# EAGLE board STM32-H407_Rev_B (EAGLE 4.16), part 1 of 2
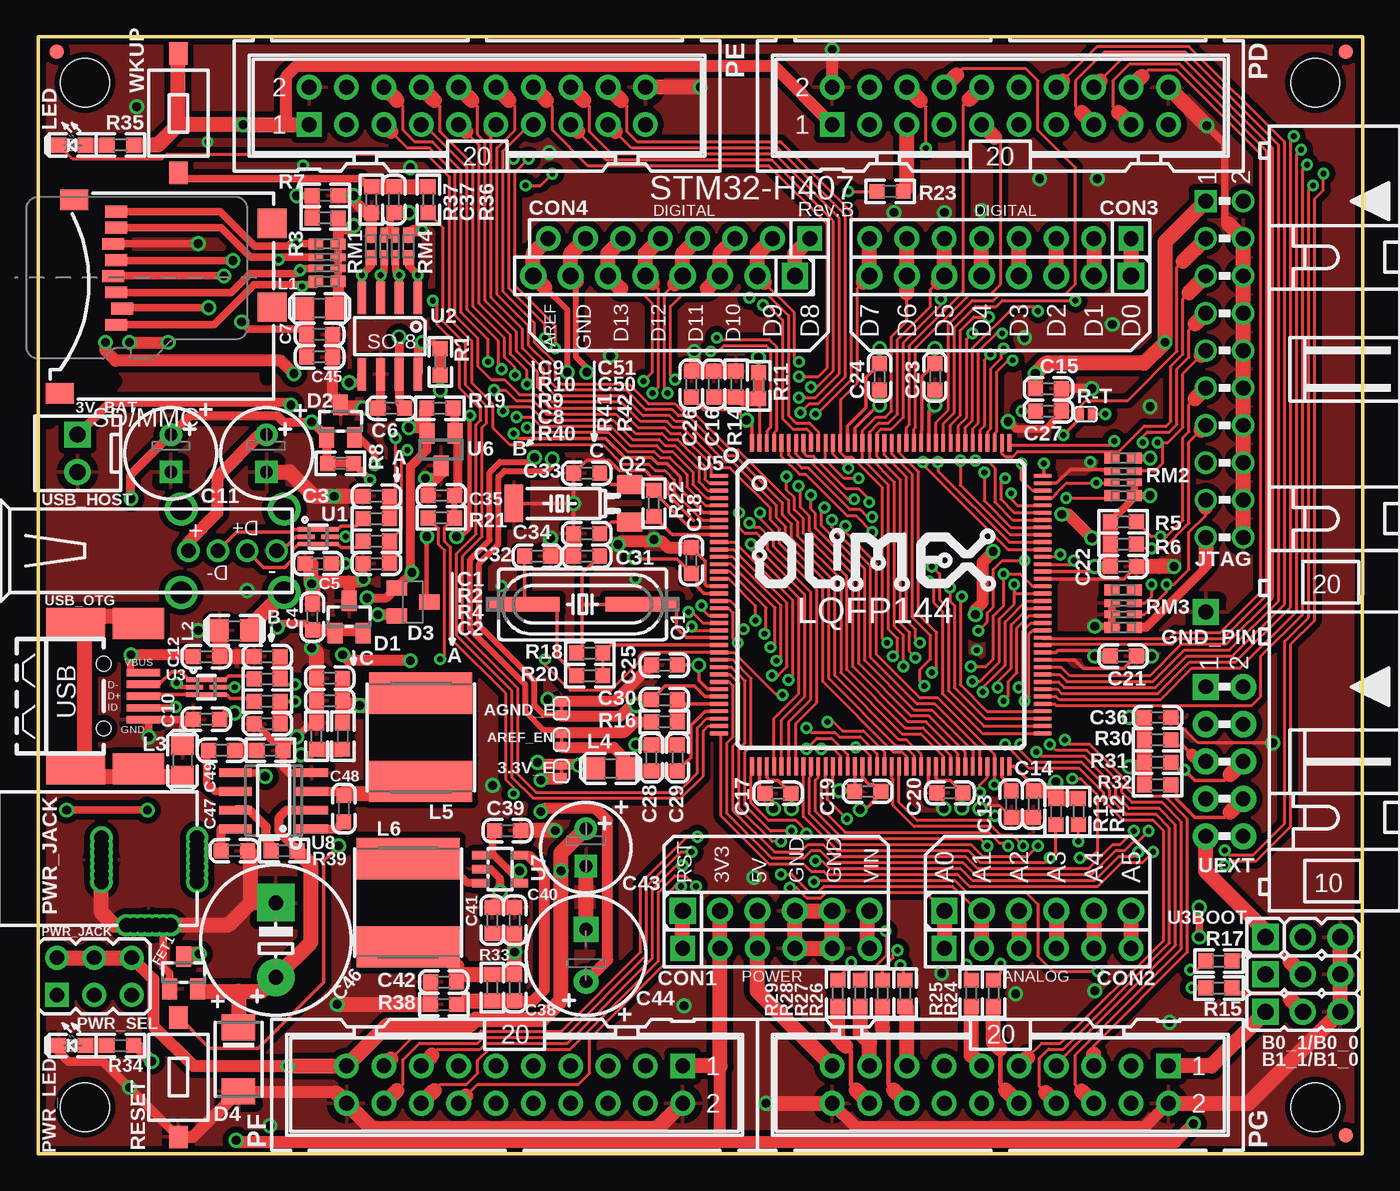
[diagram p1: board, top side]
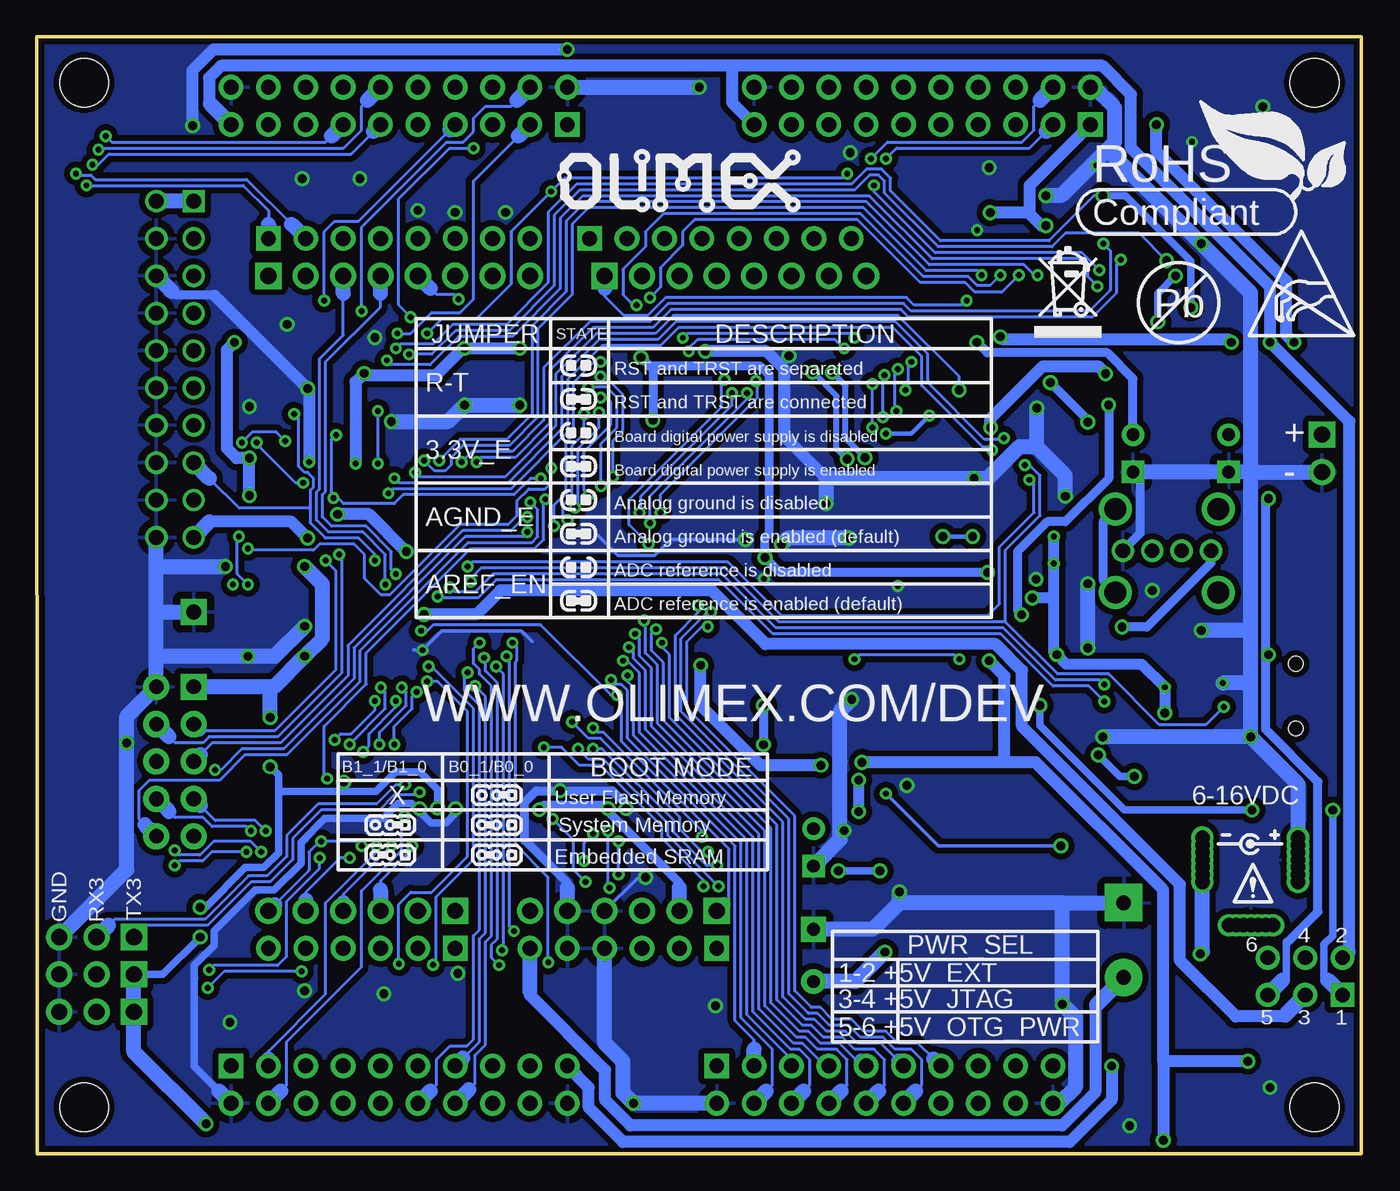
[diagram p2: board, bottom side, seen from below]

Size 90.04 x 75.95 mm. Coordinates in mm from the lower left corner, seen from the top.
Outline: 0,0 90,0 90.04,75.95 0,75.95 0,0
Copper layers (1+16): Top 0.035mm / dielectric 1.5mm / Bottom 0.035mm
Design rules "default": minimum track width 8mil, minimum drill 0.4mm, track to track 7.5mil, track to pad 7.5mil, pad to pad 7.5mil, via to via 7.5mil, smd to smd 1mil, copper to edge 10mil, drill to drill 8mil, minimum pad ring 10mil, minimum via ring 8mil, stop-mask expansion 4mil, vias tented up to drill 25mil, thermal gap 20mil
Net classes: 1 PWR: width 0.203 mm, drill 0.076 mm, clearance 0.4 mm; 2 thin: width 0.025 mm, drill 0.025 mm; 3 gsm_pwr: width 0.914 mm, clearance 0.787 mm
Holes 3.3 mm at 3.17,72.83 86.83,72.83 86.83,3.17 3.17,3.17
tRestrict: 10 lines

## Footprints (pad centres in the part's own frame; a part is rotated, then mirrored left to right if it is on the bottom)
SJ_1_SMALLER_CLOSE = smd 0.508 x 0.762: 1 -0.381,0; 2 0.381,0
CON2.54MM-2-0 = drill 1.092 pad 1.778 square: 1 -1.27,0 | drill 1.092 pad 1.778 round: 2 1.27,0
JP2 = drill 1.1 pad 1.778 square: 1 -2.54,0 | drill 1.1 pad 1.778 round: 2 0,0; 3 2.54,0
C0603_DWS = smd 1.016 x 1.016: 1 -0.889,0; 2 0.889,0
E2,5-6,3 = drill 0.864 pad 1.524 round: + -1.27,0 | drill 0.864 pad 1.524 square: - 1.27,0
E2,5-6 = drill 0.864 pad 1.524 round: + -1.27,0 | drill 0.864 pad 1.524 square: - 1.27,0
E3,5-8 = drill 0.864 pad 1.676 round: + -1.778,0 | drill 0.864 pad 1.676 square: - 1.778,0
E5-10,5 = drill 1.016 pad 2.54 round: + -2.54,0 | drill 1.016 pad 2.54 square: - 2.54,0
PN1X6 = drill 1.1 pad 1.778 square: 1 -6.35,0 | drill 1.1 pad 1.778 round: 2 -3.81,0; 3 -1.27,0; 4 1.27,0; 5 3.81,0; 6 6.35,0
PN1X8 = drill 1.1 pad 1.778 square: 1 -8.89,0 | drill 1.1 pad 1.778 round: 2 -6.35,0; 3 -3.81,0; 4 -1.27,0; 5 1.27,0; 6 3.81,0; 7 6.35,0; 8 8.89,0
SOT-23 = smd 1 x 1.4: 1 -0.95,-1.1; 2 0.95,-1.1; 3 0,1.1
SOT23C = smd 1 x 1.4: 1 -0.95,-1.1; 2 0.95,-1.1; 3 0,1.1
DO214AA = smd 1.778 x 2.286: A 2.177,0; C -2.177,0
SOT23 = smd 1 x 1.4: 1 -0.95,-1.1; 2 0.95,-1.1; 3 0,1.1
TEST_PAD40/70/SQUARE = drill 1.016 pad 1.778 square: P$1 0,0
BH20R = drill 1.016 square: 1 -11.43,-1.27 | drill 1.016 round: 2 -11.43,1.27; 3 -8.89,-1.27; 4 -8.89,1.27; 5 -6.35,-1.27; 6 -6.35,1.27; 7 -3.81,-1.27; 8 -3.81,1.27; 9 -1.27,-1.27; 10 -1.27,1.27; 11 1.27,-1.27; 12 1.27,1.27; 13 3.81,-1.27; 14 3.81,1.27; 15 6.35,-1.27; 16 6.35,1.27; 17 8.89,-1.27; 18 8.89,1.27; 19 11.43,-1.27; 20 11.43,1.27
L0805_5MIL_DWS = smd 1.27 x 1.524: 1 -1.016,0; 2 1.016,0
L7078 = smd 2.8 x 7: 1 -3,0; 2 3,0
LED-0603 = smd 1.016 x 1.016: A 0.889,0; C -0.889,0
ML20-MALE = drill 1.016 pad 1.676 square: 1 -11.43,-1.27 | drill 1.016 pad 1.676 round: 2 -11.43,1.27; 3 -8.89,-1.27; 4 -8.89,1.27; 5 -6.35,-1.27; 6 -6.35,1.27; 7 -3.81,-1.27; 8 -3.81,1.27; 9 -1.27,-1.27; 10 -1.27,1.27; 11 1.27,-1.27; 12 1.27,1.27; 13 3.81,-1.27; 14 3.81,1.27; 15 6.35,-1.27; 16 6.35,1.27; 17 8.89,-1.27; 18 8.89,1.27; 19 11.43,-1.27; 20 11.43,1.27
PWR_JACK_UNI_MILLING = drill 1 round: + 0,4.75; +1 0,5.25; +2 0,5.75; +3 0,6.25; +4 0,4.25; +5 0,3.75; +6 0,3.25; - -6.5,4.75; -1 -6.5,5.25; -2 -6.5,5.75; -3 -6.5,4.25; -4 -6.5,3.75; -5 -6.5,6.25; -6 -6.5,3.25; -- -3.3,0.3; --1 -3.8,0.3; --2 -4.3,0.3; --3 -4.8,0.3; --4 -2.8,0.3; --5 -2.3,0.3; --6 -1.8,0.3
JP3Q_NEW = drill 1 pad 1.626 square: 1 -2.54,-1.27 | drill 1 pad 1.626 round: 2 -2.54,1.27; 3 0,-1.27; 4 0,1.27; 5 2.54,-1.27; 6 2.54,1.27
HC49/SMD2_THIN = smd 5 x 1: 1 -4.064,0; 2 4.064,0
TC26H_3_REPAIR_SMD = smd 1.27 x 1.778: 1 -1.27,0; 2 1.27,0 | smd 2.54 x 1.27: GND 0,7.874
0603_0R = smd 1.016 x 1.016: 1 -0.889,0; 2 0.889,0
R0603_5MIL_DWS = smd 1.016 x 1.016: 1 -0.889,0; 2 0.889,0
R0603_5MIL_DWS_NA = smd 1.016 x 1.016: 1 -0.889,0; 2 0.889,0
SJ_1_SMALLER = smd 0.508 x 0.762: 1 -0.381,0; 2 0.381,0
SW-TAKT_6X3.5_SMD = smd 1.27 x 1.524: P$1 0,4.064; P$2 0,-4.064
R_MATRIX_4 = smd 1.016 x 0.762: 1.1 -0.762,1.27; 1.2 0.762,1.27; 4.1 -0.762,-1.27; 4.2 0.762,-1.27 | smd 1.016 x 0.508: 2.1 -0.762,0.381; 2.2 0.762,0.381; 3.1 -0.762,-0.381; 3.2 0.762,-0.381
TFR-MEM-CON = smd 0.8 x 1.5: 1 -3.2,10.7; 2 -2.1,10.3; 3 -1,10.7; 4 0.1,10.9; 5 1.2,10.7; 6 2.3,10.9; 7 3.4,10.7; 8 4.5,10.7 | smd 2 x 2: 9 3.7,0.1; 10 -2,0.1 | smd 1.4 x 1.9: 11 5.3,13.55; 12 -7.85,14.55
USBLC6-2P6 = smd 0.3 x 1.46: 1 -0.5,-0.65; 3 0.5,-0.65; 4 0.5,0.65; 6 -0.5,0.65 | smd 0.3 x 1.16: 2 0,-0.8; 5 0,0.8
SO-8 = smd 0.6 x 2.2: 1 -1.905,-2.6; 2 -0.635,-2.6; 3 0.635,-2.6; 4 1.905,-2.6; 5 1.905,2.6; 6 0.635,2.6; 7 -0.635,2.6; 8 -1.905,2.6
HN1X3 = drill 1.1 pad 1.778 square: 1 -2.54,0 | drill 1.1 pad 1.778 round: 2 0,0; 3 2.54,0
ARDUINO_SHIELD_PLATFORM_WITHOUT_DIMENSION = drill 1.016 pad 1.676 round: 3V3 22.86,2.54; 5V 25.4,2.54; A1 40.64,2.54; A2 43.18,2.54; A3 45.72,2.54; A4 48.26,2.54; A5 50.8,2.54; AREF 11.176,50.8; D1 48.26,50.8; D2 45.72,50.8; D3 43.18,50.8; D4 40.64,50.8; D5 38.1,50.8; D6 35.56,50.8; D7 33.02,50.8; D9 26.416,50.8; D10 23.876,50.8; D11 21.336,50.8; D12 18.796,50.8; D13 16.256,50.8; GND 27.94,2.54; GND@1 30.48,2.54; GND@2 13.716,50.8; VIN 33.02,2.54 | drill 1.016 pad 1.676 square: A0 38.1,2.54; D0 50.8,50.8; D8 28.956,50.8; RST 20.32,2.54
LQFP144 = smd 1.2 x 0.254: 1 -11,8.75; 2 -11,8.25; 3 -11,7.75; 4 -11,7.25; 5 -11,6.75; 6 -11,6.25; 7 -11,5.75; 8 -11,5.25; 9 -11,4.75; 10 -11,4.25; 11 -11,3.75; 12 -11,3.25; 13 -11,2.75; 14 -11,2.25; 15 -11,1.75; 16 -11,1.25; 17 -11,0.75; 18 -11,0.25; 19 -11,-0.25; 20 -11,-0.75; 21 -11,-1.25; 22 -11,-1.75; 23 -11,-2.25; 24 -11,-2.75; 25 -11,-3.25; 26 -11,-3.75; 27 -11,-4.25; 28 -11,-4.75; 29 -11,-5.25; 30 -11,-5.75; 31 -11,-6.25; 32 -11,-6.75; 33 -11,-7.25; 34 -11,-7.75; 35 -11,-8.25; 36 -11,-8.75; 73 11,-8.75; 74 11,-8.25; 75 11,-7.75; 76 11,-7.25; 77 11,-6.75; 78 11,-6.25; 79 11,-5.75; 80 11,-5.25; 81 11,-4.75; 82 11,-4.25; 83 11,-3.75; 84 11,-3.25; 85 11,-2.75; 86 11,-2.25; 87 11,-1.75; 88 11,-1.25; 89 11,-0.75; 90 11,-0.25; 91 11,0.25; 92 11,0.75; 93 11,1.25; 94 11,1.75; 95 11,2.25; 96 11,2.75; 97 11,3.25; 98 11,3.75; 99 11,4.25; 100 11,4.75; 101 11,5.25; 102 11,5.75; 103 11,6.25; 104 11,6.75; 105 11,7.25; 106 11,7.75; 107 11,8.25; 108 11,8.75 | smd 0.254 x 1.2: 37 -8.75,-11; 38 -8.25,-11; 39 -7.75,-11; 40 -7.25,-11; 41 -6.75,-11; 42 -6.25,-11; 43 -5.75,-11; 44 -5.25,-11; 45 -4.75,-11; 46 -4.25,-11; 47 -3.75,-11; 48 -3.25,-11; 49 -2.75,-11; 50 -2.25,-11; 51 -1.75,-11; 52 -1.25,-11; 53 -0.75,-11; 54 -0.25,-11; 55 0.25,-11; 56 0.75,-11; 57 1.25,-11; 58 1.75,-11; 59 2.25,-11; 60 2.75,-11; 61 3.25,-11; 62 3.75,-11; 63 4.25,-11; 64 4.75,-11; 65 5.25,-11; 66 5.75,-11; 67 6.25,-11; 68 6.75,-11; 69 7.25,-11; 70 7.75,-11; 71 8.25,-11; 72 8.75,-11; 109 8.75,11; 110 8.25,11; 111 7.75,11; 112 7.25,11; 113 6.75,11; 114 6.25,11; 115 5.75,11; 116 5.25,11; 117 4.75,11; 118 4.25,11; 119 3.75,11; 120 3.25,11; 121 2.75,11; 122 2.25,11; 123 1.75,11; 124 1.25,11; 125 0.75,11; 126 0.25,11; 127 -0.25,11; 128 -0.75,11; 129 -1.25,11; 130 -1.75,11; 131 -2.25,11; 132 -2.75,11; 133 -3.25,11; 134 -3.75,11; 135 -4.25,11; 136 -4.75,11; 137 -5.25,11; 138 -5.75,11; 139 -6.25,11; 140 -6.75,11; 141 -7.25,11; 142 -7.75,11; 143 -8.25,11; 144 -8.75,11
SOT23-5 = smd 0.55 x 1.2: 1 -0.95,-1.3; 2 0,-1.3; 3 0.95,-1.3; 4 0.95,1.3; 5 -0.95,1.3
SOIC8 = smd 0.6 x 2.2: 1 -1.905,-2.6; 2 -0.635,-2.6; 3 0.635,-2.6; 4 1.905,-2.6; 5 1.905,2.6; 6 0.635,2.6; 7 -0.635,2.6; 8 -1.905,2.6
FIDUCIAL-1X2 = smd 1 x 1: 1 0,0
BH10R = drill 1 pad 1.778 square: 1 -5.08,-1.27 | drill 1 pad 1.778 round: 2 -5.08,1.27; 3 -2.54,-1.27; 4 -2.54,1.27; 5 0,-1.27; 6 0,1.27; 7 2.54,-1.27; 8 2.54,1.27; 9 5.08,-1.27; 10 5.08,1.27
USB_A_VERTICAL_PTH = drill 1 round: 1 3.45,12.75; 2 3.45,14.75; 3 3.45,16.75; 4 3.45,18.75 | drill 1.5 round: P$1 0.6,12.25; P$2 6.3,12.25; P$3 6.3,19.25; P$4 0.6,19.25
USB_MINI_9PIN = smd 2.25 x 0.5: D+ 2.706,0; D- 2.706,0.8; GND 2.706,-1.6; ID 2.706,-0.8; VBUS 2.706,1.6 | smd 4 x 2.1: GND1 -1.9,4.95; GND3 -1.9,-4.95 | smd 3.5 x 2.1: GND2 2.35,4.95; GND4 2.35,-4.95 | hole 1: 0,2.2; 0,-2.2

## Placement (x,y rotation side)
3.3V_E  Close  [SJ_1_SMALLER_CLOSE]  35.56,26.01 90 top
3V_BAT  WF2S  [CON2.54MM-2-0]  2.67,47.62 270 top
AGND_E  Close  [SJ_1_SMALLER_CLOSE]  35.56,30.28 90 top
AREF_EN  Close  [SJ_1_SMALLER_CLOSE]  35.56,28.14 90 top
B0_1/B0_0  HN1x3(B0_1:Open;B0_0:Close)  [JP2]  85.98,12.19 0 top
B1_1/B1_0  HN1x3(B1_1:Open;B1_0:Close)  [JP2]  85.98,9.65 0 top
C1  47pF(NA)  [C0603_DWS]  22.99,44.7 180 top
C2  47pF(NA)  [C0603_DWS]  22.99,40.13 180 top
C3  100uF/35V/LOWESR/105C/6.3x11mm_RM2.5  [E2,5-6,3]  15.52,47.62 270 top
C4  100nF  [C0603_DWS]  18.64,36.5 90 top
C5  100nF  [C0603_DWS]  19.02,40.13 0 top
C6  100nF  [C0603_DWS]  24,50.7 180 top
C7  22uF/6.3V  [C0603_DWS]  19.13,55.7 0 top
C8  47pF(NA)  [C0603_DWS]  15.57,29.24 180 top
C9  47pF(NA)  [C0603_DWS]  15.57,33.81 180 top
C10  100nF  [C0603_DWS]  11.43,29.54 0 top
C11  100uF/35V/LOWESR/105C/6.3x11mm_RM2.5  [E2,5-6,3]  9.02,47.62 270 top
C12  100nF  [C0603_DWS]  11.43,33.81 0 top
C13  2.2uF/6.3V  [C0603_DWS]  66.14,23.77 90 top
C14  10uF/6.3V  [C0603_DWS]  67.67,23.77 90 top
C15  10uF/6.3V  [C0603_DWS]  68.68,52.02 180 top
C16  100nF  [C0603_DWS]  45.92,52.32 270 top
C17  10uF/6.3V  [C0603_DWS]  50.29,24.51 0 top
C18  10uF/6.3V  [C0603_DWS]  44.4,40.34 270 top
C19  100nF  [C0603_DWS]  56.39,24.64 0 top
C20  100nF  [C0603_DWS]  61.98,24.54 0 top
C21  100nF  [C0603_DWS]  73.76,33.83 180 top
C22  100nF  [C0603_DWS]  73.76,39.93 180 top
C23  100nF  [C0603_DWS]  60.96,52.83 90 top
C24  100nF  [C0603_DWS]  57.2,52.83 90 top
C25  100nF  [C0603_DWS]  42.57,33.22 0 top
C26  100nF  [C0603_DWS]  44.4,52.32 270 top
C27  2.2uF/6.3V  [C0603_DWS]  68.68,50.5 180 top
C28  10uF/6.3V  [C0603_DWS]  41.68,26.92 90 top
C29  100nF  [C0603_DWS]  43.46,26.92 270 top
C30  100nF  [C0603_DWS]  42.57,30.89 0 top
C31  27pF  [C0603_DWS]  37.29,40.64 180 top
C32  27pF  [C0603_DWS]  33.93,40.64 0 top
C33  15pF  [C0603_DWS]  37.29,46.28 180 top
C34  15pF  [C0603_DWS]  37.29,42.16 180 top
C35  100nF  [C0603_DWS]  27.41,44.75 0 top
C36  100nF  [C0603_DWS]  76.1,29.67 180 top
C37  100nF  [C0603_DWS]  24.18,64.87 270 top
C38  22pF  [C0603_DWS]  32.38,11.3 270 top
C39  22uF/6.3V  [C0603_DWS]  31.9,21.97 0 top
C40  22uF/6.3V  [C0603_DWS]  32.38,15.88 90 top
C41  22uF/6.3V  [C0603_DWS]  30.86,15.88 90 top
C42  100nF  [C0603_DWS]  27.56,11.68 180 top
C43  100uF/16V/mini  [E2,5-6]  37.24,20.83 270 top
C44  220uF/16V/mini  [E3,5-8]  37.24,13.49 90 top
C45  22uF/6.3V  [C0603_DWS]  19.13,54.18 0 top
C46  470uF/25V/LOWESR/105C  [E5-10,5]  16.15,14.53 90 top
C47  100nF  [C0603_DWS]  13.34,20.6 0 top
C48  10nF  [C0603_DWS]  20.78,23.47 90 top
C49  3.3nF  [C0603_DWS]  12.47,27.43 0 top
C50  22uF/6.3V  [C0603_DWS]  19.81,30.81 180 top
C51  22uF/6.3V  [C0603_DWS]  19.81,32.33 180 top
CON1  NA(PN1X6)  [PN1X6]  50.16,16.51 0 top
CON2  NA(PN1X6)  [PN1X6]  67.94,16.51 0 top
CON3  NA(PN1X8)  [PN1X8]  65.41,59.69 180 top
CON4  NA(PN1X8)  [PN1X8]  42.55,59.69 180 top
D1  NA(ESDA6V1L)  [SOT-23]  21.13,36.5 0 top
D2  NA(ESDA6V1L)  [SOT-23]  20.55,49.81 0 top
D3  BAT54C  [SOT23C]  25.48,37.52 270 top
D4  SMBJ16A  [DO214AA]  13.61,6.43 270 top
FET1  IRLML6402  [SOT23]  9.88,12.32 0 top
GND_PIN  TESTPAD3  [TEST_PAD40/70/SQUARE]  79.38,36.83 0 top
JTAG  BH20R  [BH20R]  80.64,53.34 270 top
L1  CL470nH/0805/1.76R/250mA  [L0805_5MIL_DWS]  19.13,57.48 180 top
L2  FB0805/600R/200mA(201209-601)  [L0805_5MIL_DWS]  13.34,35.59 0 top
L3  FB0805/600R/200mA(201209-601)  [L0805_5MIL_DWS]  9.8,26.75 270 top
L4  FB0805/600R/200mA(201209-601)  [L0805_5MIL_DWS]  38.91,26.21 0 top
L5  10uH/2.3A/YS75/7x8  [L7078]  26.01,28.32 90 top
L6  2.2uH/3A/YS75/7x8  [L7078]  25.15,17.07 270 top
LED  LED/GREEN/0603  [LED-0603]  2.29,68.58 0 top
PD  NA(BH20S)  [ML20-MALE]  65.41,71.25 0 top
PE  NA(BH20S)  [ML20-MALE]  29.84,71.25 0 top
PF  NA(BH20S)  [ML20-MALE]  32.38,4.7 180 top
PG  NA(BH20S)  [ML20-MALE]  65.41,4.7 180 top
PWR_JACK  YDJ-1136  [PWR_JACK_UNI_MILLING]  10.79,15.24 0 top
PWR_LED  LED/RED/0603  [LED-0603]  2.29,7.37 0 top
PWR_SEL  HN2x3(1-2:Close)  [JP3Q_NEW]  3.81,12.06 0 top
Q1  Q12.000MHz/HC-49SM(SMD)/20pF  [HC49/SMD2_THIN]  37.01,37.36 0 top
Q2  32768Hz/6pF  [TC26H_3_REPAIR_SMD]  40.21,44.22 90 top
R1  0R(board_mounted)  [0603_0R]  27.33,53.85 90 top
R2  15R  [R0603_5MIL_DWS]  22.99,43.18 180 top
R3  NA  [R0603_5MIL_DWS_NA]  19.51,63.63 180 top
R4  15R  [R0603_5MIL_DWS]  22.99,41.66 180 top
R5  NA  [R0603_5MIL_DWS_NA]  73.76,42.98 180 top
R6  NA  [R0603_5MIL_DWS_NA]  73.76,41.45 180 top
R7  1M  [R0603_5MIL_DWS]  19.51,65.15 0 top
R8  0R(board_mounted)  [0603_0R]  20.55,46.94 180 top
R9  15R  [R0603_5MIL_DWS]  15.57,30.76 180 top
R10  15R  [R0603_5MIL_DWS]  15.57,32.28 180 top
R11  0R(board_mounted)  [0603_0R]  48.97,52.22 90 top
R12  NA(10k)  [R0603_5MIL_DWS_NA]  70.71,23.27 90 top
R13  NA(10k)  [R0603_5MIL_DWS_NA]  69.19,23.27 90 top
R14  NA  [R0603_5MIL_DWS_NA]  47.45,52.32 90 top
R15  4.7k  [R0603_5MIL_DWS]  80.26,11.28 0 top
R16  15R  [R0603_5MIL_DWS]  42.57,29.36 0 top
R17  4.7k  [R0603_5MIL_DWS]  80.26,13.11 0 top
R18  NA  [R0603_5MIL_DWS_NA]  37.49,34.04 180 top
R19  10k/1%  [R0603_5MIL_DWS]  27.3,50.7 180 top
R20  150R  [R0603_5MIL_DWS]  37.49,32.51 0 top
R21  1k  [R0603_5MIL_DWS]  27.41,43.23 0 top
R22  NA  [R0603_5MIL_DWS_NA]  41.86,44.22 90 top
R23  NA  [R0603_5MIL_DWS_NA]  57.91,65.43 0 top
R24  NA  [R0603_5MIL_DWS]  64.95,10.92 270 top
R25  NA  [R0603_5MIL_DWS]  63.42,10.92 90 top
R26  NA  [R0603_5MIL_DWS]  58.93,10.92 90 top
R27  NA  [R0603_5MIL_DWS]  57.4,10.92 270 top
R28  NA  [R0603_5MIL_DWS]  55.88,10.92 90 top
R29  NA  [R0603_5MIL_DWS]  54.36,10.92 270 top
R30  4.7k  [R0603_5MIL_DWS]  76.1,28.14 180 top
R31  4.7k  [R0603_5MIL_DWS]  76.1,26.62 180 top
R32  47k/1%  [R0603_5MIL_DWS]  76.1,25.1 180 top
R33  4.99k/1%  [R0603_5MIL_DWS]  30.86,11.3 270 top
R34  1k  [R0603_5MIL_DWS]  5.59,7.37 180 top
R35  1k  [R0603_5MIL_DWS]  5.59,68.58 0 top
R36  1k  [R0603_5MIL_DWS]  26.52,64.87 270 top
R37  47k/1%  [R0603_5MIL_DWS]  22.66,64.87 90 top
R38  1.1k/1%  [R0603_5MIL_DWS]  27.56,10.16 180 top
R39  47k  [R0603_5MIL_DWS]  16.71,20.6 180 top
R40  2.2k  [R0603_5MIL_DWS]  15.77,27.43 0 top
R41  1.1k/1%  [R0603_5MIL_DWS]  18.92,28.4 90 top
R42  4.99k/1%  [R0603_5MIL_DWS]  20.7,28.4 90 top
R-T  Open  [SJ_1_SMALLER]  71.22,50.29 0 top
RESET  T1107A-6_3.8_2.5  [SW-TAKT_6X3.5_SMD]  9.53,5.21 0 top
RM1  33k  [R_MATRIX_4]  19.63,60.58 0 top
RM2  NA(10k)  [R_MATRIX_4]  73.76,46.02 0 top
RM3  10k  [R_MATRIX_4]  73.76,37.06 180 top
RM4  33k  [R_MATRIX_4]  23.9,61.7 90 top
SD/MMC  MICRO  [TFR-MEM-CON]  16,59.56 90 top
U1  NA(USBLC6-2P6)  [USBLC6-2P6]  19.02,41.96 270 top
U2  MIC2026-1YM  [SO-8]  23.9,55.6 180 top
U3  NA(USBLC6-2P6)  [USBLC6-2P6]  11.43,31.72 270 top
U3BOOT  NA(HN1X3)  [HN1X3]  85.98,14.73 0 top
U4  NA(2xPN1x6_2xPN1x8)  [ARDUINO_SHIELD_PLATFORM_WITHOUT_DIMENSION]  23.5,11.43 0 top
U5  STM32F407ZGT6  [LQFP144]  57.28,37.34 0 top
U6  NA  [SOT23]  27.38,47.88 180 top
U7  SY8008C(AA)C  [SOT23-5]  31.39,19.35 270 top
U8  MP1482DS  [SOIC8]  16,24 90 top
U$1  FIDUCIAL1X2  [FIDUCIAL-1X2]  1.27,74.93 0 top
U$2  FIDUCIAL1X2  [FIDUCIAL-1X2]  88.9,74.93 0 top
U$4  [OLIMEX1_V]  36.96,63.88 0 bottom
U$5  [ESD_SYMBOL]  7.62,55.63 0 bottom
U$6  [PB]  12.42,57.86 0 bottom
U$7  [OLIMEX1_V]  66.24,38.1 0 top
U$8  [RECYCLE_BIN1/8]  22.23,55.5 0 bottom
U$9  FIDUCIAL1X2  [FIDUCIAL-1X2]  88.9,1.27 0 top
U$15  [ROHS]  18.29,63.14 0 bottom
U$16  [ATTENTION_SMALL]  8.64,17.14 0 bottom
UEXT  BH10R  [BH10R]  80.64,26.67 270 top
USB_HOST  USB_A_VERTICAL  [USB_A_VERTICAL_PTH]  -2.54,44.45 270 top
USB_OTG  USB-OTG  [USB_MINI_9PIN]  4.45,31.11 0 top
WKUP  T1107A-6_3.8_2.5  [SW-TAKT_6X3.5_SMD]  9.53,70.74 0 top

## Tracks (layer width: path | path; a pad name or v marks a point on that pad's centre or on a via)
+5V  (via drill 0.6)
  Top 0.508: 30.89,20.3 30.98,20.3 32.49,18.8 32.49,18.39 32.47,18.41 U7.4 32.72,18.38 v32.72,19.23 | 30.89,20.3 U7.1 | 30.89,20.3 30.89,21.84 C39.1
  Top 0.61: C6.1 24.54,51.05 U2.7 v24.54,55.55
  Top 0.813: PWR_SEL.6 7.82,11.86 7.82,8.71 10.57,5.97 v16.97,5.97 | v6.2,55.17 v8.84,55.17
  Top 1.016: CON1.3 U4.5V 48.9,11.05 PG.19 | PWR_SEL.2 PWR_SEL.4 PWR_SEL.6 | C43.+ 37.19,22.1 35.53,20.45 v35.53,19.23 35.53,10.44 34.24,9.14 29.74,9.14 29.34,8.74 23.72,8.74 PF.19 v16.97,5.97
  Bottom 0.508: v35.53,19.23 v32.72,19.23
  Bottom 0.813: v16.97,5.97 16.97,3.66 19.81,0.81 50.19,0.81 52.53,3.15 52.53,4.52 PG.19 | 78.23,71.37 78.33,71.48 78.33,73.15 77.52,73.97 42.77,73.97 | PE.19 42.77,71.48 42.77,73.97 | 42.77,73.97 17.58,73.97 15.65,72.03 15.65,68.38 6.2,58.93 v6.2,55.17 0.81,49.78 0.81,13.79 0.91,13.69 | v8.84,55.17 9.04,55.37 24.36,55.37 v24.54,55.55
  Bottom 1.016: 78.23,71.37 PD.19 | PWR_SEL.2 0.91,13.69
+5V_EXT  (via drill 0.6)
  Top 0.508: v1.93,23.37 v7.42,23.37
  Top 1.016: 20.7,30.48 R42.2 | C51.1 C50.1 20.7,30.48 | 24.49,30.48 | 20.7,30.48 v21.84,30.48 24.49,30.48 | 24.49,30.48 25.17,30.48 L5.2
  Bottom 0.508: 2.29,11.81 2.54,12.06 2.54,14.22 1.93,14.83 v1.93,23.37 | v21.84,30.48 21.84,29.11 16.1,23.37 v7.42,23.37
  Bottom 1.016: PWR_SEL.1 2.29,11.81
+5V_HOST_PWR  (via drill 0.6)
  Top 0.406: v26.14,55.17 26.9,55.17 R1.2
  Top 0.508: v16.26,35.81 16.51,36.07 18.19,36.07 C4.1
  Top 0.61: v26.14,55.17 25.81,54.84 U2.8
  Top 0.813: C4.1 20.18,35.61 | 20.18,35.61 D1.1 | D1.2 22.08,35.61 20.18,35.61 | USB_HOST.1 10.21,41.6 12.19,43.59 12.19,46.02 15.06,48.9 C3.+
  Bottom 0.61: v16.26,35.81 14.58,35.81 10.21,40.18 USB_HOST.1 | C3.+ 15.52,52.7 17.27,54.46 25.43,54.46 v26.14,55.17
+5V_JTAG  (via drill 0.6)
  Top 0.61: RM3.1.1 75.31,35.79 79.38,39.85 79.38,40.16
  Top 0.813: v71.63,41.86 70,43.48 v69.6,43.48 | v63.7,36.68 63.7,36.98 64.21,37.49 64.21,40.23 v64.92,40.95
  Top 1.016: JTAG.19 79.38,40.16
  Bottom 0.813: v71.63,41.86 72.75,42.98 78.31,42.98 | v69.6,43.48 67.46,43.48 v64.92,40.95 | v63.7,36.68 60.15,36.68 58.52,38.3 44.17,38.3 40.51,34.65 24.84,34.65 23.06,32.87 23.06,29.06 12.32,18.31 12.32,13.13 8.53,9.35 5.26,9.35 5.16,9.45
  Bottom 1.016: 78.31,42.98 JTAG.19 | PWR_SEL.3 5.16,9.45
+5V_OTG_PWR  (via drill 0.6)
  Top 0.508: 19.6,47 R8.2 | USB_OTG.VBUS 6.3,32.72 v6.3,33.93
  Top 0.61: v21.13,52.43 22,52.43 U2.5 | 19.6,48.78 D2.1 19.6,47 | 19.6,48.78 18.59,49.78 v18.59,49.76 16.69,49.76 16.26,50.19 10.31,50.19 C11.+ 6.3,46.18 v6.3,44.55 | 19.6,48.78 19.6,48.55
  Top 0.762: C12.1 10.41,33.93 v6.3,33.93
  Bottom 0.508: 5.33,11.81 5.08,12.06 5.08,14.33 5.03,14.38
  Bottom 0.61: v18.59,49.76 18.59,49.89 v21.13,52.43 | 6.5,33.93 6.5,44.35 v6.3,44.55 | 6.5,33.93 6.5,28.85 2.95,25.3 2.95,16.46 5.03,14.38 | 6.5,33.93 v6.3,33.93
  Bottom 1.016: PWR_SEL.5 5.33,11.81
+7V
  Top 0.254: U5.33 45.33,30.09 44.37,29.13 44.37,26.95 C29.2
  Top 0.508: AREF_EN.1 35.56,27.64
  Top 0.762: L4.2 39.93,26.82 39.12,27.64 35.56,27.64
  Top 1.016: C29.2 C28.1 39.93,26.04 L4.2
+15V
  Top 0.61: U8.2 16.89,23.37 16.38,22.86 16.38,21.87 17.6,20.65 R39.1
  Top 1.016: FET1.2 11,11.05 13.61,11.05 | 13.61,11.05 15.21,11.05 C46.+ 18.54,14.38 18.54,19.66 R39.1 | 13.61,11.05 D4.C | CON1.6 56.39,16.38 56.39,14.1 U4.VIN
  Bottom 0.813: 17.98,10.16 18.09,10.06 18.09,4.17 20.32,1.93 49.68,1.93 51.41,3.66 51.41,5.69 56.52,10.79 56.52,11.05
  Bottom 1.016: C46.+ 17.98,10.16 | 56.52,11.05 U4.VIN
AGND  (via drill 0.6)
  Top 0.254: U5.31 45.31,31.09 44.6,31.8 42.6,31.8 C30.1
  Top 0.406: 36.58,59.31 36.58,54.15 37.29,53.44 v37.29,53.14 | v34.95,47.24 34.95,46.84 34.54,46.43 31.7,46.43 31.29,46.02 31.29,41.45 29.97,40.13 29.97,35.92 33.73,32.16 33.73,30.48 34.34,29.87 35.53,29.87 AGND_E.1
  Top 0.508: AGND_E.1 35.56,29.77
  Top 0.762: v40.64,27.81 C28.2 | C30.1 41.05,30.89 v40.64,30.48 40.64,30.58 40.39,30.58 39.57,29.77 35.56,29.77
  Top 1.016: U4.GND@2 36.2,61.21 CON4.7 36.58,59.31 | C28.2 C29.1
  Bottom 0.406: v37.29,53.14 35.66,51.51 35.66,47.95 v34.95,47.24
  Bottom 0.61: v40.64,30.48 v40.64,27.81
AREF  (via drill 0.6)
  Top 0.406: 35.97,52.93 v35.97,53.14 35.97,57.38 34.44,58.9 | v33.73,47.35 33.43,47.04 31.39,47.04 30.68,46.33 30.68,41.73 29.36,40.41 29.36,35.64 33.12,31.88 33.12,30.07 34.37,28.83 35.38,28.83 35.56,28.65
  Top 0.508: 35.56,28.65 AREF_EN.2
  Top 0.762: R16.1 40.56,29.36 39.85,28.65 35.56,28.65
  Top 1.016: U4.AREF 33.66,61.21 CON4.8 34.44,58.9
  Bottom 0.406: v33.73,47.35 35.05,48.67 35.05,52.22 v35.97,53.14
BOOT0  (via drill 0.4)
  Top 0.203: v55.47,44.5 55.04,44.5 52.53,47.02 52.09,47.02 51.53,47.58 U5.138 | R17.1 78.77,12.5 v78.33,12.5 | v70.81,20.12 71.53,20.12 72.03,20.62 72.03,24.36 70.89,25.5 v70.31,25.5
  Bottom 0.203: v55.47,44.5 55.58,44.4 55.58,41.76 56.19,41.15 60.55,41.15 67.64,34.06 67.64,31.93 70.51,29.06 70.51,25.7 v70.31,25.5 | v78.33,12.5 78.03,12.8 73.66,12.8 73.05,13.41 73.05,17.17 70.81,19.41 v70.81,20.12
GND  (via drill 0.4, 0.6)
  Top 0.203: C36.1 77.11,29.67 78.84,27.94 v83.92,27.94 | v64.01,23.47 64.11,23.57 64.11,23.67 65.35,23.67 C13.1
  Top 0.254: USB_HOST.4 16.57,41 17.53,41.96 U1.2 | U5.16 45.44,38.59 45.31,38.71 45.31,40.31 C18.1 | U5.130 55.53,49.33 57.1,50.9 v57.2,50.9 | 44.55,43.05 42.8,44.81 42.8,45.64 42.42,46.02 41.71,46.02 41.27,46.46 39.52,46.46 38.84,47.14 37.26,47.14 C33.2 v36.4,44.22 | 71.53,46.53 72.87,46.53 RM2.2.1 | U5.107 69.22,45.59 70.16,46.53 71.53,46.53 | v71.53,47.04 71.53,46.53 | U5.83 70.45,33.59 71.04,32.99 73.81,32.99 C21.1 | U5.94 73.81,39.09 C22.1 | U5.51 55.53,24.67 C19.1 55.45,24.69 v54.46,24.69 | U5.61 60.53,25.1 C20.1 61.09,24.36 61.57,23.88 v61.57,23.47 | U5.38 49.03,24.89 C17.1 49.99,23.93 v49.99,23.47 | U5.120 60.53,48.95 60.55,48.97 60.55,50.49 v60.96,50.9 | v36.4,44.22 Q2.GND | v36.4,44.22 C34.2
  Top 0.305: U3.2 9.68,31.73 v9.4,32
  Top 0.508: 7.52,29.52 USB_OTG.GND | 7.52,29.52 9.8,29.52 9.8,29.46 | 9.8,29.46 L3.1 | C10.1 9.88,29.54 9.8,29.46 | 16.66,28.07 R40.2 16.66,26.26 17.02,25.91 U8.4 | FET1.1 8.93,12.25 8.51,12.68 8.51,15.54 | U7.2 30.76,19.36 31.39,18.72 v31.39,17.8 | RM3.3.2 RM3.2.2 RM3.1.2 73,35.87 v71.83,35.87 | v7.52,28.35 7.52,29.52 | 35.56,30.79 AGND_E.2 | v65.94,49.78 66.45,49.28 68.5,49.28 69.57,50.34 C27.1 | SD/MMC.6 5.11,61.87 v10.87,61.87 | 16.66,28.07 17.3,28.07 v17.58,28.35 18.26,29.03 18.67,29.03 R41.2 | 16.66,28.07 15.95,28.07 14.78,29.23 C8.2 | 80.92,63.22 80.67,63.48 80.67,68.68 v79.45,69.9
  Top 0.61: C6.2 23.27,50.85 U2.6 | v10.87,35.59 L2.1 | v22.1,39.06 C2.2 | v71.63,52.02 C15.1 | PWR_LED.C 1.4,6.93 2.03,6.3 4.37,6.3 RESET.P$2
  Top 0.762: v21.44,65.15 21.44,64.82 22.28,63.98 R37.1 22.63,63.98 RM4.1.2 | v75.69,33.83 C21.1 | v34.65,30.89 34.75,30.79 35.56,30.79 39.22,30.79 41.66,33.22 C25.1 | D2.3 20.02,51.44 C45.2 | RM4.4.2 25.5,62.79 v26.11,62.79
  Top 0.813: 20.27,4.12 20.17,4.22 13.65,4.22 D4.A 10.51,1.14 RESET.P$2 | v57.2,50.9 C24.1 | v60.96,50.9 C23.1 | v44.6,54.56 44.6,53.21 | PG.20 55.58,1.83 75.23,1.83 PG.2 | 22.45,1.93 22.55,1.83 42.22,1.83 42.32,1.93 | v39.42,41.43 39.65,41.66 42.37,41.66 42.8,41.22 C18.1 | 26.52,45.92 C35.1 | v26.31,45.92 26.52,45.92 | v22.1,39.06 21.95,38.91 21.13,38.91 | 21.13,38.91 18.59,38.91 v18.59,38.76 | 21.13,38.91 D1.3 | v53.98,75.08 PD.2 | U6.3 27.38,46.28 27.03,45.92 26.52,45.92
  Top 1.016: B1_1/B1_0.3 B0_1/B0_0.3 | B1_1/B1_0.3 U3BOOT.3 | PG.2 82.3,3.43 B1_1/B1_0.3 | v49.48,3.43 PG.20 | 20.27,4.12 PF.20 22.45,1.93 | JTAG.20 JTAG.18 JTAG.16 JTAG.14 JTAG.12 JTAG.10 JTAG.8 JTAG.6 JTAG.4 80.92,63.22 | PE.20 v45.01,72.52 45.01,72.54 | C9.2 C12.2 L2.1 | R41.2 C50.2 C51.2 18.92,34.06 v18.59,34.39 | PWR_JACK.- 4.29,16.41 5.16,15.54 PWR_JACK.-- 8.51,15.54 12.9,15.54 14.43,17.07 | C46.- 14.43,17.07 | 14.43,17.07 14.43,20.4 C47.2 | 31.39,16.76 C41.2 | C45.2 C7.2 | v21.44,65.15 R7.2 | C13.1 C14.1 | C26.1 44.6,53.21 C16.1 R14.2 | v77.22,39.93 C22.1 | 42.32,1.93 PF.2 | D2.3 20.55,50.7 v22.05,50.7 C6.2 | C44.- C43.- | C42.2 R38.2 v20.32,10.16 | v35.15,21.97 C39.2 | C34.2 C31.2 C32.2 v34.82,41.86 | C15.1 C27.1 | C1.2 v20.12,44.7 18.75,44.7 17.09,46.35 C3.- | C5.1 18.54,40.13 18.54,38.81 v18.59,38.76 18.64,38.71 C4.2 | v79.45,69.9 PD.20 | 31.39,16.76 C40.2 | v31.39,17.8 31.39,16.76 | U4.GND CON1.4 CON1.5 U4.GND@1 U4.GND
  Bottom 0.254: v41.86,41.76 46.94,41.76 48.03,40.66 50.52,40.66 51.92,42.06 | v48.67,18.8 49.15,18.8 CON1.4 | 56.39,34.85 57.07,35.53 62.51,35.53 v63.8,34.24 64.41,34.24
  Bottom 0.508: v61.57,23.47 61.57,23.16 62.23,22.5 63.25,22.5 64.01,23.27 v64.01,23.47 64.21,23.47 64.57,23.82 65.48,23.82 66.5,22.81 70.46,22.81 72.08,21.18 72.08,19.76 73.91,17.93 75.21,17.93 77.98,15.16 77.98,14.17 79.35,12.8 79.35,5.94 77.67,4.27 | 15.04,42.77 15.04,42.72
  Bottom 0.61: v49.99,23.47 49.99,23.77 50.9,24.69 v54.46,24.69 56.08,24.69 56.9,23.88 56.9,21.34 53.98,18.41 53.98,18.11 | C3.- 15.04,45.87 15.04,42.77 15.04,42.17 USB_HOST.4 | v36.4,44.22 36.4,45.95 | 80.85,58.62 80.64,58.42 78.03,58.42 77.93,58.32
  Bottom 0.813: v44.6,54.56 40.44,54.56 39.22,53.34 39.22,48.77 36.4,45.95 | v71.53,47.04 71.53,51.92 v71.63,52.02 77.93,58.32 | v53.98,75.08 78.03,75.08 79.45,73.66 v79.45,69.9
  Bottom 1.016: PF.2 v49.48,3.43 50.19,4.14 50.19,6.3 51.44,7.54 U4.GND | 81.92,33.93 UEXT.2 83.92,29.74 v83.92,27.94 83.92,19.33 U3BOOT.3 | 81.92,33.93 81.92,36.83 | 81.92,36.83 81.92,39.93 | 81.92,39.93 JTAG.20 | 81.92,36.83 GND_PIN.P$1 | PD.2 v45.01,72.52 | C3.- C11.- 7.52,46.35 | v57.2,50.9 v60.96,50.9 62.08,49.78 v65.94,49.78 | CON1.5 53.98,18.11 | PG.2 77.67,4.27 | 81.92,39.93 v77.22,39.93 | 81.92,33.93 81.92,33.83 v75.69,33.83 73.86,33.83 v71.83,35.87 | PF.20 20.55,3.43 19.41,4.57 19.41,9.25 v20.32,10.16 20.32,17.07 | v7.52,28.35 v17.58,28.35 | C43.- 35.43,21.36 35.43,21.97 | PE.2 18.16,72.52 16.76,71.12 16.76,68.78 17.27,68.28 | 17.27,68.28 R7.2 v21.44,65.15 | v34.82,41.86 38.99,41.86 v39.42,41.43 | 35.43,21.97 v35.15,21.97 | 35.43,21.97 35.43,30.1 v34.65,30.89 | 17.27,68.28 v10.87,61.87 7.52,58.52 7.52,46.35 | 7.52,35.59 v10.87,35.59 | v7.52,28.35 7.52,32 | 7.52,32 7.52,35.59 | 7.52,32 v9.4,32 | v20.12,44.7 20.12,46.13 22.05,48.06 | v18.59,34.39 v18.59,38.76 | PWR_JACK.- 4.29,25.12 v7.52,28.35 | 7.52,35.59 7.52,46.35 | 7.52,46.35 3V_BAT.2 | v36.4,44.22 36.4,45.92 v26.31,45.92 25.4,45.92 23.27,48.06 22.05,48.06 | 31.39,17.07 33.2,15.27 C44.- | JTAG.6 80.85,58.62 | 20.32,17.07 31.39,17.07 | 31.39,17.07 v31.39,17.8 | 20.32,17.07 C46.- | 22.05,48.06 v22.05,50.7
  other vias: 73.03,56.39 67.06,55.5 72.01,66.29 68.07,66.29 58.17,64.01 61.59,64.01 64.14,64.14 18,67.2 40.6,39.1 31.5,38.6 30.88,25.04 14.2,38.3 6.2,4.5 6.7,71.2 11.5,68.8 38.91,54.25 71.83,11.07 61.42,12.27 66.45,10.87 76.91,8.94 75.59,50.8 43.89,10.06 34.75,68.07 25.3,67.06 15.75,1.91
  pour Bottom (isolate 0.406, rank 4): -2.54,78.74 92.71,78.74 92.71,-2.54 -2.54,-2.54
  pour Top (isolate 0.406, rank 4): -5.08,81.28 95.25,81.28 95.25,-5.08 -5.08,-5.08
LED
  Top 0.203: LED.C 2.31,67.67 8.43,67.67 8.74,67.97 26.42,67.97 27.94,66.45 27.94,56.79 29.46,55.27 29.46,52.43 30.89,51 30.89,49.38 32.05,48.21 38.38,48.21 39.7,46.89 41.5,46.89 41.94,46.46 42.6,46.46 43.23,45.82 43.23,44.98 45.13,43.09 U5.7
N$1
  Top 0.254: U5.23 44.06,35.09 43.38,35.76 43.38,36.98 43,37.36 Q1.2 36.98,37.36 | R18.2 36.98,34.42 36.98,37.36 | 36.98,37.36 36.98,39.45 C31.1
N$2
  Top 0.254: R20.1 35.28,33.83 35.28,37.36 33.05,37.36 | 33.05,37.36 Q1.1 | 33.05,37.36 C32.1
N$3
  Top 0.203: R20.2 R18.1
  Top 0.254: U5.24 38.93,34.59 R18.1
N$4  (via drill 0.4)
  Top 0.203: RM3.2.1 75.18,36.68 76.71,38.2 v76.71,38.71 77.22,38.71 78.23,39.73 78.23,42.27 79.38,43.41 79.38,43.97
  Top 1.016: 79.38,43.97 JTAG.17
N$5
  Top 1.016: LED.A R35.1
N$6
  Top 0.203: R23.2 59.05,65.68
  Top 1.016: 59.05,65.68 PD.5
N$8
  Top 0.508: 33.43,20.2 33.43,20.19 33.31,20.3 U7.5
  Top 0.762: C38.2 32.33,10.36 33.6,10.36 34.42,11.18 34.42,19.21 33.43,20.2
  Top 1.016: R38.1 28.91,10.16 29.16,10.41 R33.2 C38.2
N$9
  Top 0.305: 85.09,13.08 84.71,13.46 81.51,13.46 R17.2
  Top 1.016: 85.09,13.08 B0_1/B0_0.2
N$10  (via drill 0.6)
  Top 0.508: 35.56,25.5 3.3V_E.1
  Top 0.762: v34.16,25.4 34.27,25.5 35.56,25.5 | v34.16,23.27 34.37,23.47 37.9,23.47 38.71,22.66 38.71,13.18 C44.+
  Top 1.016: 28.45,12.19 R33.1 C38.1 v32.38,13.72 C40.1 C41.1 | 28.45,12.19 C42.1 | 28.45,12.19 28.45,12.75 27.13,14.07 L6.2
  Bottom 0.762: v34.16,23.27 v34.16,25.4
  Bottom 1.016: v32.38,13.72 34.39,11.71 C44.+
N$12
  Top 1.016: PG.11 63.42,6.68 R25.1
N$13
  Top 0.305: 65.76,4.34 65.41,4.7 65.41,7.11
  Top 1.016: 65.41,7.11 64.95,7.57 R24.2 | 65.76,4.34 PG.10
N$14
  Top 0.305: 58.14,4.34 57.78,4.7 57.78,8.13 57.4,8.51
  Top 1.016: 58.14,4.34 PG.16 | 57.4,8.51 R27.2
N$15
  Top 0.254: U1.6 20.36,42.46 20.6,42.7 21.61,42.7 R2.2
N$16
  Top 0.254: U1.4 20.36,41.46 20.6,41.22 21.67,41.22 R4.2
N$17
  Top 0.305: 55.6,4.34 55.24,4.7 55.24,6.99 55.12,6.99 55.12,7.11 54.89,7.34
  Top 1.016: 55.6,4.34 PG.18 | R29.2 54.36,7.87 54.89,7.34
N$18
  Top 1.016: R28.1 55.88,8.2 56.52,7.57 PG.17
N$19
  Top 1.016: R26.1 59.05,9.91 PG.15
N$25
  Top 0.508: WKUP.P$2 9.53,66.29 21.89,66.29 22.66,65.53 R37.2
  Top 1.016: R37.2 C37.1 R36.1
N$29
  Top 0.305: 85.09,10.54 84.71,10.92 81.51,10.92 R15.2
  Top 1.016: 85.09,10.54 B1_1/B1_0.2
N$31  (via drill 0.6)
  Top 1.016: FET1.3 9.88,13.59 v10.95,13.59
  Bottom 1.016: PWR_JACK.+ 10.79,13.74 v10.95,13.59
N$36
  Top 0.61: U8.8 12.45,22.1 C47.1
N$37
  Top 0.61: U8.7 14.35,23.37 15.49,22.23 15.49,21.34 15.82,21.01 R39.2
N$41
  Top 0.254: U3.4 12.79,31.23 13.06,30.96 14.48,30.96 R9.2
N$43
  Top 0.254: U3.6 12.69,32.23 12.95,32.49 14.48,32.49 R10.2
N$46
  Top 0.61: U8.1 20.3,22.1 C48.1
N$50
  Top 0.61: U8.3 20.5,24.64 C48.2
  Top 1.016: C48.2 20.78,24.49 25.17,24.49 L5.1
N$60
  Top 0.508: U8.6 12.01,24.64 11.46,25.2 11.46,27.3 C49.1
N$61
  Top 1.016: R40.1 C49.2
N$62  (via drill 0.6)
  Top 0.508: U8.5 15.16,25.91 v15.42,25.65 | v17.88,27.13 18.54,27.13 R41.1
  Top 1.016: R41.1 R42.1
  Bottom 0.508: v15.42,25.65 16.41,25.65 v17.88,27.13
N$64
  Top 0.508: U7.3 29.2,18.41 28.38,19.22 26.43,19.22 25.57,20.07 L6.1
N$75  (via drill 0.6)
  Top 0.61: 3V_BAT.1 4.88,51.1 16.97,51.1 v17.17,50.9 | 24.27,36.57 D3.2
  Top 0.762: 24.27,36.57 24.19,36.65 v23.09,36.65
  Bottom 0.61: v23.09,36.65 23.37,36.93 23.37,40.95 21.34,42.98 20.12,42.98 17.17,45.92 v17.17,50.9
N$78  (via drill 0.6)
  Top 0.508: SD/MMC.4 5.13,59.69 v12.62,59.69 | v13.82,56.57 14.3,56.08 18.24,56.08
  Top 1.016: L1.2 18.24,57.48 18.24,56.08 C7.1 C45.1
  Bottom 0.508: v12.62,59.69 13.82,58.5 v13.82,56.57
N$85  (via drill 0.4)
  Top 0.203: RM3.3.1 75.23,37.44 75.69,37.9 v75.69,38.71 | R5.1 75.67,41.96 v76.3,41.96 76.71,41.96 77.83,43.08 77.83,48.69 78.23,49.1 78.23,50.93 78.64,51.33
  Top 1.016: 78.64,51.33 JTAG.11
  Bottom 0.203: v75.69,38.71 76.4,39.42 76.4,41.86 v76.3,41.96
N$117
  Top 0.254: U5.71 65.53,25.61 65.76,25.38 65.76,25.04 C13.2
N$128  (via drill 0.4)
  Top 0.203: U5.106 67.59,45.09 66.85,45.82 v66.85,46.94 | v66.85,50.49 C27.2
  Bottom 0.203: v66.85,46.94 v66.85,50.49
N$129
  Top 1.016: PWR_LED.A R34.2
N$163  (via drill 0.4, 0.6)
  Top 0.203: v32.31,24.49 32.31,24.92 31.8,25.43 31.8,31.29 28.04,35.05 28.04,41.22 27.64,41.63 27.64,42.57 R21.2
  Top 0.254: RESET.P$1 9.58,9.27 11.66,7.19 14.94,7.19 19.41,11.66 19.41,19.91 v20.42,20.93
  Top 0.406: R21.2 C35.2
  Top 0.61: C35.2 28.55,45.01 28.55,48.76 U6.1 28.33,50.56 R19.1
  Bottom 0.254: v20.42,20.93 28.75,20.93 v32.31,24.49
N$266
  Top 1.016: USB_HOST.P$3 14.35,35.79 L2.2
  Bottom 0.61: USB_HOST.P$3 17.53,38.97 17.53,43.03 USB_HOST.P$4
N$470
  Top 0.203: R11.1 49.03,51.28 U5.143
  Top 1.016: C16.2 R14.1 47.83,51.44 47.93,51.33 R11.1
PA0/WKUP
  Top 0.203: U5.34 45.44,29.59 44.81,28.96 44.81,25.91 43.48,24.59 33.83,24.59 32.61,25.81 32.61,31.65 28.85,35.41 28.85,40.64 30.18,41.96 30.18,49.38 30.48,49.68 30.48,50.83 29.06,52.25 29.06,55.07 27.53,56.59 27.53,62.97 R36.2
PA1/D8  (via drill 0.4)
  Top 0.203: U5.35 45.55,29.09 45.21,28.75 45.21,25.7 43.69,24.18 33.63,24.18 32.21,25.6 32.21,31.47 28.45,35.23 28.45,40.82 29.77,42.14 29.77,49.58 30.07,49.89 30.07,50.65 28.65,52.07 28.65,54.86 27.13,56.39 27.13,57.71 v26.82,58.01
  Top 1.016: CON4.1 51.44,61.21 U4.D8
  Bottom 0.203: v26.82,58.01 27.13,57.71 30.4,57.71 30.91,58.22 47.3,58.22 48.51,57 50.11,57 51.44,58.32 51.44,58.85
  Bottom 1.016: 51.44,58.85 CON4.1
PA2/USART2_TX  (via drill 0.4)
  Top 0.203: U5.36 46.43,28.59 46.43,22.96 49.68,19.71 52.02,19.71 52.53,19.2 53.39,19.2 53.59,19 62.48,19 63.3,18.19 72.03,18.19 73.66,19.81 75.08,19.81 v75.79,20.52 | v80.67,19.61 80.97,19.91 82.8,19.91 85.14,22.25 85.14,34.65 86.77,36.27 86.77,64.92 87.38,65.53 v87.38,66.65
  Top 1.016: U4.D1 CON3.2
  Bottom 0.203: v75.79,20.52 78.16,20.52 78.77,19.91 80.37,19.91 v80.67,19.61 | v87.38,66.65 87.27,66.55 86.36,66.55 86.06,66.24 75.77,66.24 72.72,63.2
  Bottom 1.016: 72.72,63.2 U4.D1
PA3/USART2_RX  (via drill 0.4)
  Top 0.203: U5.37 48.53,25.77 48.46,25.7 48.46,23.85 49.66,22.66 51.51,22.66 52.22,21.95 v52.22,21.74 | v52.83,19.91 53.26,19.91 53.77,19.41 62.69,19.41 63.5,18.59 71.83,18.59 73.46,20.22 74.47,20.22 v74.78,20.52 | v80.67,20.62 80.97,20.32 82.6,20.32 84.73,22.45 84.73,34.85 86.36,36.47 86.36,65.53 v86.67,65.84
  Top 1.016: U4.D0 CON3.1
  Bottom 0.203: v52.22,21.74 52.83,21.13 v52.83,19.91 | v74.78,20.52 75.49,21.23 78.03,21.23 78.94,20.32 80.37,20.32 v80.67,20.62 | v86.67,65.84 76,65.84 74.3,64.14 74.3,63.2
  Bottom 1.016: 74.3,63.2 U4.D0
PA4/D10/SPI1_NSS  (via drill 0.4)
  Top 0.203: v43.28,52.63 42.98,52.93 42.98,57.61 43.79,58.42 45.09,58.42 45.49,58.83 | U5.40 50.03,29.61 51.71,31.29 51.71,37.8 48.46,41.05 v48.46,41.45
  Top 1.016: U4.D10 46.35,61.21 CON4.3 45.49,58.83
  Bottom 0.203: v48.46,41.45 49.78,42.77 49.78,44.48 43.48,50.77 43.48,52.43 v43.28,52.63
PA5/D13/SPI1_SCK  (via drill 0.4)
  Top 0.203: 39.6,58.83 40.01,58.42 41.15,58.42 41.76,57.81 41.76,53.14 v41.15,52.53 | U5.41 50.53,29.5 52.12,31.09 52.12,38 49.17,40.95 49.17,41.86 48.87,42.16 48.06,42.16 47.65,42.57 v47.65,43.59
  Top 1.016: U4.D13 38.73,61.21 CON4.6 39.6,58.83
  Bottom 0.203: v47.65,43.59 47.65,44.81 41.05,51.41 41.05,52.43 v41.15,52.53
PA6/D12/SPI1_MISO  (via drill 0.4)
  Top 0.203: v41.76,51.71 42.16,52.12 42.16,58.8 41.76,59.21 | U5.42 51.03,29.39 52.53,30.89 52.53,38.18 49.58,41.12 49.58,42.06 49.07,42.57 48.67,42.57 v48.36,42.88
  Top 1.016: U4.D12 41.27,61.21 CON4.5 41.76,59.21
  Bottom 0.203: v41.76,51.71 41.76,51.31 48.36,44.7 v48.36,42.88
PA7/D11/SPI1_MOSI  (via drill 0.4)
  Top 0.203: v42.77,51.71 42.57,51.92 42.57,58.45 43.28,59.16 | U5.43 51.53,29.28 52.93,30.68 52.93,38.35 49.99,41.3 49.99,42.27 49.07,43.18 v49.07,43.59
  Top 1.016: U4.D11 43.81,61.21 CON4.4 43.28,59.16
  Bottom 0.203: v49.07,43.59 48.97,43.69 48.97,44.7 42.77,50.9 v42.77,51.71
PA8/USB_HS_VBUSON  (via drill 0.4)
  Top 0.203: v62.69,47.14 62.69,45.47 66.06,42.09 U5.100
  Top 0.508: RM4.1.1 22.63,60.38 v22,59.74 U2.4
  Bottom 0.203: v62.69,47.14 61.27,48.56 58.12,48.56 56.39,50.29 56.39,56.29 54.05,58.62 54.05,63.4 52.73,64.72 33.63,64.72 29.36,60.45 22.94,60.45 22.23,59.74 v22,59.74
PA9/OTG_FS_VBUS  (via drill 0.4, 0.6)
  Top 0.203: v64.31,46.33 64.31,44.4 66.12,42.59 U5.101
  Top 0.406: R1.1 v27.33,51.92
  Bottom 0.203: v64.31,46.33 64.01,46.02 58.22,46.02 54.76,49.48 54.76,53.01 51.99,55.78 47.98,55.78 46.76,57 31.5,57 27.33,52.83 v27.33,51.92
PA10/USB_FS_VBUSON  (via drill 0.4)
  Top 0.203: v63.7,47.14 64.52,47.14 65.02,46.63 65.02,44.3 66.23,43.09 U5.102
  Top 0.508: RM4.4.1 25.17,60.38 v25.81,59.74 25.83,59.72 25.81,59.69 U2.1
  Bottom 0.203: v63.7,47.14 62.99,46.43 62.28,46.43 61.87,46.84 61.87,47.35 61.06,48.16 57.91,48.16 55.98,50.09 55.98,56.08 53.65,58.42 53.65,63.2 52.53,64.31 33.83,64.31 29.57,60.05 26.11,60.05 v25.81,59.74
PA11/OTG_FS_DM  (via drill 0.4)
  Top 0.203: v65.73,45.92 65.43,45.62 65.43,44.5 66.34,43.59 U5.103 | v24.28,48.67 24.28,45.11 C1.1
  Top 1.016: C1.1 R2.1
  Bottom 0.203: v65.73,45.92 65.43,45.62 58.01,45.62 54.36,49.28 54.36,52.83 51.82,55.37 47.8,55.37 46.58,56.59 31.67,56.59 29.46,54.38 29.46,52.43 25.6,48.56 24.38,48.56 v24.28,48.67
PA12/OTG_FS_DP  (via drill 0.4)
  Top 0.203: v66.14,44.91 66.14,44.5 66.55,44.09 U5.104 | R4.1 24.69,42.47 24.69,47.45 v25.09,47.85
  Top 1.016: C2.1 R4.1
  Bottom 0.203: v66.14,44.91 65.84,45.21 57.81,45.21 53.95,49.07 53.95,52.63 51.61,54.97 47.62,54.97 46.41,56.19 31.85,56.19 29.87,54.2 29.87,52.22 25.7,48.06 25.3,48.06 v25.09,47.85
PA13/TMS  (via drill 0.4)
  Top 0.203: RM2.3.1 72.97,45.62 v71.93,45.62 69.9,45.62 69.19,44.91 69.19,44.83 68.95,44.59 U5.105 | v75.08,48.36 75.08,48.77 75.39,49.07 76.91,49.07 77.42,49.58 77.42,53.34 78.23,54.15 78.23,56.01 78.64,56.41
  Top 1.016: 78.64,56.41 JTAG.7
  Bottom 0.203: v71.93,45.62 72.44,45.62 75.08,48.26 v75.08,48.36
PA14/TCK  (via drill 0.4)
  Top 0.203: RM2.2.2 75.89,46.41 76.4,46.91 76.4,48.36 | 79.05,54.28 77.83,53.06 77.83,49.38 76.81,48.36 76.4,48.36 | U5.109 66.03,48.17 72.86,48.17 v73.15,48.46 | v76.1,48.36 76.4,48.36
  Top 1.016: 79.05,54.28 JTAG.9
  Bottom 0.203: v73.15,48.46 73.76,49.07 75.39,49.07 v76.1,48.36
PA15/TDI
  Top 0.203: U5.110 65.53,47.6 65.73,47.4 66.24,47.4 66.6,47.75 73,47.75 | 73,47.75 RM2.1.1 | 73,47.75 73.46,47.75 75.18,49.48 76.71,49.48 77.01,49.78 77.01,53.54 77.83,54.36 77.83,58.14 78.23,58.55
  Top 1.016: 78.23,58.55 JTAG.5
PB0/A2  (via drill 0.4)
  Top 0.203: U5.46 53.03,25.59 52.83,25.4 52.83,23.29 54.69,21.44 64.01,21.44 v64.52,20.93
  Top 1.016: CON2.3 U4.A2
  Bottom 0.203: v64.52,20.93 64.52,20.73 66.67,18.57 66.67,17.96
  Bottom 1.016: 66.67,17.96 CON2.3
PB1/A3  (via drill 0.4)
  Top 0.203: U5.47 53.53,25.51 53.24,25.22 53.24,23.47 54.86,21.84 64.62,21.84 65.33,21.13 65.73,21.13 v65.94,20.93
  Top 1.016: 69.22,16.64 CON2.4 U4.A3
  Bottom 0.203: v65.94,20.93 69.22,17.65 69.22,17.09
  Bottom 1.016: 69.22,17.09 CON2.4
PB2  (via drill 0.4)
  Top 0.203: U5.48 54.03,25.43 53.65,25.04 53.65,24.08 v54.97,22.76 | v52.73,18.49 52.83,18.59 62.31,18.59 63.12,17.78 67.16,17.78 67.97,16.97 67.97,13.41 68.99,12.39 v72.03,12.39 | v78.44,11.28 R15.1
  Bottom 0.203: v52.73,18.49 53.54,19.3 53.54,21.34 v54.97,22.76 | v72.03,12.39 77.32,12.39 v78.44,11.28
PB3/TDO  (via drill 0.4)
  Top 0.203: U5.133 54.03,47.57 54.97,46.63 v55.07,46.63 | 79.05,49.2 78.23,48.39 78.23,42.88 76.5,41.15 v75.69,41.15 74.95,41.15 R6.1
  Top 1.016: 79.05,49.2 JTAG.13
  Bottom 0.203: v55.07,46.63 55.07,45.62 55.47,45.21 56.59,45.21 57.4,44.4 57.4,43.38 58.01,42.77 61.27,42.77 66.04,38 66.65,38 67.77,39.12 67.77,40.74 68.48,41.45 70.81,41.45 71.22,41.05 75.59,41.05 v75.69,41.15
PB4/TRST  (via drill 0.4)
  Top 0.203: U5.134 53.53,47.18 54.79,45.92 v55.78,45.92 | v69.88,44.58 72.82,44.58 RM2.4.1 | R-T.1 70.84,50.83 71.22,51.21 74.07,51.21 77.42,54.56 77.42,60.27 77.83,60.68
  Top 0.254: R-T.1 70.84,50.01 v69.7,48.87
  Top 1.016: 77.83,60.68 JTAG.3
  Bottom 0.203: v55.78,45.92 56.49,45.92 57.61,44.81 65.13,44.81 65.73,44.2 69.19,44.2 69.57,44.58 v69.88,44.58 70,44.7 70,48.56 v69.7,48.87
PB5/USB_HS_FAULT  (via drill 0.4)
  Top 0.203: U5.135 53.03,49.08 52.43,49.68 51.51,49.68 51,50.19 51,57 49.58,58.42 48.56,58.42 v48.36,58.22
  Top 0.508: RM4.2.1 23.52,59.99 v23.27,59.74 U2.3
  Bottom 0.203: v48.36,58.22 47.65,58.93 47.65,60.25 46.13,61.77 46.13,62.69 45.31,63.5 34.24,63.5 29.97,59.23 26.92,59.23 26.26,58.57 24.43,58.57 v23.27,59.74
PB6/USB_FS_FAULT  (via drill 0.4)
  Top 0.203: U5.136 52.53,49 52.25,49.28 51.31,49.28 50.6,49.99 50.6,56.69 49.58,57.71 v49.28,57.71
  Top 0.508: RM4.3.1 24.28,59.99 v24.54,59.74 U2.2
  Bottom 0.203: v49.28,57.71 49.48,57.71 50.19,58.42 50.19,60.15 48.67,61.67 48.67,62.69 47.45,63.91 34.04,63.91 29.77,59.64 26.72,59.64 26.11,59.03 25.25,59.03 v24.54,59.74
PB8/I2C1_SCL  (via drill 0.4)
  Top 0.203: U5.139 51.03,47.5 51.92,46.61 52.35,46.61 55.17,43.79 55.88,43.79 56.39,43.28 v56.69,43.28
  Top 0.254: R30.1 77.37,27.76 77.8,27.76 78.44,27.13
  Top 0.813: 79.05,26.67 78.89,26.67 78.44,27.13
  Top 1.016: UEXT.5 79.05,26.67
  Bottom 0.203: v56.69,43.28 56.9,43.28 57.81,42.37 61.09,42.37 68.89,34.57 68.89,32.51 73.46,27.94 78.11,27.94 78.92,27.13
  Bottom 1.016: 78.92,27.13 UEXT.5
PB9/I2C1_SDA  (via drill 0.4)
  Top 0.203: U5.140 50.53,47.41 51.74,46.2 52.17,46.2 54.99,43.38 55.58,43.38 v56.69,42.27
  Top 0.254: 81.03,25.78 80.64,25.4 78.64,25.4 v77.93,26.11 77.5,26.11 R31.1
  Top 1.016: 81.03,25.78 UEXT.6
  Bottom 0.203: v56.69,42.27 57,41.96 60.91,41.96 68.48,34.39 68.48,32.31 73.25,27.53 76.1,27.53 77.52,26.11 v77.93,26.11
PB10/SPI2_SCK/UART3_TX  (via drill 0.4)
  Top 0.203: U5.69 64.52,26.34 64.52,25.6 64.01,25.09 v64.01,24.59
  Top 1.016: U3BOOT.1 83.44,15.14 79.38,19.2 UEXT.9
  Bottom 0.203: v64.01,24.59 64.21,24.38 65.73,24.38 66.75,23.37 70.71,23.37 72.64,21.44 72.64,20.02 74.17,18.49 75.46,18.49 78.41,15.54 82.63,15.54 83.03,15.14
  Bottom 1.016: 83.03,15.14 U3BOOT.1
PB12/OTG_HS_ID  (via drill 0.4)
  Top 0.203: U5.73 64.17,28.59 61.47,31.29 61.47,36.88 60.86,37.49 60.86,38.61 v60.55,38.91
  Top 0.508: USB_OTG.ID 9.28,30.32 v9.35,30.38 | v22.86,46.84 22.86,47.65 21.8,48.71 D2.2
  Bottom 0.203: v9.35,30.38 10.57,29.16 13.72,29.16 17.17,32.61 20.62,32.61 24.18,36.17 | v60.55,38.91 60.55,39.12 59.84,39.83 43.26,39.83 39.6,36.17 24.18,36.17 | v22.86,46.84 22.55,46.84 21.84,46.13 21.84,43.38 24.18,41.05 24.18,36.17
PB13/OTG_HS_VBUS  (via drill 0.4)
  Top 0.203: U5.74 64.28,29.09 61.87,31.5 61.87,37.08 61.27,37.69 61.27,39.42 v60.76,39.93
  Top 0.508: v22.55,45.82 R8.1
  Bottom 0.203: v60.76,39.93 60.45,40.23 43.05,40.23 39.4,36.58 25.4,36.58 24.59,37.39 24.59,41.25 22.25,43.59 22.25,45.52 v22.55,45.82
PB14/OTG_HS_DM  (via drill 0.4)
  Top 0.203: v61.98,38.51 61.98,37.59 62.28,37.29 62.28,31.7 64.39,29.59 U5.75 | 16.46,32.41 16.46,32.31 16.87,31.9 v17.48,31.9
  Top 1.016: R10.1 16.46,32.41 C9.1
  Bottom 0.203: v61.98,38.51 61.67,38.2 60.25,38.2 59.03,39.42 43.46,39.42 39.8,35.76 24.33,35.76 20.78,32.21 17.78,32.21 v17.48,31.9
PB15/OTG_HS_DP  (via drill 0.4)
  Top 0.203: U5.76 64.5,30.09 62.69,31.9 62.69,37.8 v62.79,37.9 | R9.1 v17.48,30.76
  Top 1.016: C8.1 R9.1
  Bottom 0.203: v62.79,37.9 62.69,37.8 60.05,37.8 58.83,39.01 43.66,39.01 40.01,35.36 24.51,35.36 20.95,31.8 18.52,31.8 v17.48,30.76
PC0/A0  (via drill 0.4)
  Top 0.203: U5.26 47.22,33.58 48.46,32.33 48.46,27.74 48.06,27.33 48.06,23.67 49.78,21.95 v51.21,21.95 | v51.1,18.09 51.56,18.09 52.27,17.37 53.16,17.37 53.57,17.78 60.33,17.78 CON2.1
  Top 1.016: CON2.1 U4.A0
  Bottom 0.203: v51.1,18.09 51.21,18.19 v51.21,21.95
PC1/A1  (via drill 0.4)
  Top 0.203: U5.27 46.28,33.07 47.14,33.07 48.06,32.16 48.06,27.94 47.65,27.53 47.65,23.5 49.91,21.23 v50.49,21.23 | v50.49,19 51.21,19 52.43,17.78 53.01,17.78 53.42,18.19 62.15,18.19 63.83,16.51 CON2.2
  Top 1.016: CON2.2 U4.A1
  Bottom 0.203: v50.49,19 v50.49,21.23
PC2/SPI2_MISO  (via drill 0.4)
  Top 0.203: U5.28 46.28,32.56 47.07,32.56 47.65,31.98 47.65,28.14 47.24,27.74 47.24,23.32 50.04,20.52 51.82,20.52 52.32,21.03 53.34,21.03 54.15,20.22 63.04,20.22 63.86,19.41 71.42,19.41 73.05,21.03 73.56,21.03 v74.47,21.95
  Bottom 0.203: v74.47,21.95 75.18,22.66 77.9,22.66 78.92,23.67
  Bottom 1.016: 78.92,23.67 UEXT.7
PC3/SPI2_MOSI  (via drill 0.4)
  Top 0.203: U5.29 46.97,32.08 47.24,31.8 47.24,28.35 46.84,27.94 46.84,23.14 49.86,20.12 52.05,20.12 52.55,20.62 53.14,20.62 53.95,19.81 62.87,19.81 63.68,19 71.63,19 73.25,20.62 73.86,20.62 74.47,21.23 74.78,21.23 v75.49,21.95
  Top 0.254: R32.1 77.37,24.71 77.37,24.13 78.64,22.86 80.64,22.86 81.03,23.24
  Top 1.016: UEXT.8 81.03,23.24
  Bottom 0.203: v75.49,21.95 75.79,22.25 78.13,22.25 78.74,22.86 80.64,22.86 81.05,23.27
  Bottom 1.016: 81.05,23.27 UEXT.8
PC4/A4  (via drill 0.4)
  Top 0.203: R13.1 69.19,20.52 v68.78,20.12 68.48,19.81 64.03,19.81 63.22,20.62 54.33,20.62 52.02,22.94 52.02,26.33 U5.44
  Top 1.016: CON2.5 U4.A4
  Bottom 0.203: v68.78,20.12 69.42,20.12 71.75,17.78 71.75,17.25
  Bottom 1.016: 71.75,17.25 CON2.5
PC5/A5  (via drill 0.4)
  Top 0.203: U5.45 52.53,25.68 52.43,25.58 52.43,23.11 54.51,21.03 63.4,21.03 64.21,20.22 67.26,20.22 v67.97,20.93 | v70.71,21.23 R12.1
  Top 1.016: CON2.6 U4.A5
  Bottom 0.203: v67.97,20.93 68.28,21.23 v70.71,21.23 70.81,21.23 71.53,20.52 71.53,19.28 73.86,16.94
  Bottom 1.016: 73.86,16.94 CON2.6
PC6/USART6_TX  (via drill 0.4)
  Top 0.203: U5.96 68.28,40.03 70.1,40.03 v70.41,40.34
  Bottom 0.203: v70.41,40.34 69.7,39.62 69.7,32.92 73.86,28.75 78.92,28.75 79.02,28.85
  Bottom 1.016: 79.02,28.85 UEXT.3
PC7/USART6_RX  (via drill 0.4)
  Top 0.203: U5.97 69.34,40.59 v69.49,40.74
  Bottom 0.203: v69.49,40.74 69.29,40.54 69.29,32.72 73.66,28.35 78.33,28.35 78.74,27.94 80.64,27.94 81.05,28.35
  Bottom 1.016: 81.05,28.35 UEXT.4
PC8/SD_D0  (via drill 0.4)
  Top 0.203: U5.98 65.92,41.09 60.15,46.86 v60.15,47.04
  Top 0.508: SD/MMC.7 12.42,62.96 14.43,60.96 16.33,60.96 | 16.33,60.96 RM1.2.1 | 16.33,60.96 v16.33,60.78
  Bottom 0.203: v60.15,47.04 59.84,47.35 57.51,47.35 55.17,49.68 55.17,53.24 52.22,56.19 48.16,56.19 46.94,57.4 31.29,57.4 30.79,56.9 18.26,56.9 16.64,58.52 16.64,60.48 v16.33,60.78
PC9/SD_D1  (via drill 0.4)
  Top 0.203: U5.99 66.01,41.59 61.16,46.43 v61.16,47.04
  Top 0.508: RM1.1.1 18.85,61.87 v17.53,61.87 17.14,61.87 16.99,61.72 14.71,61.72 12.37,64.06 SD/MMC.8
  Bottom 0.203: v61.16,47.04 60.45,47.75 57.71,47.75 55.58,49.89 55.58,53.44 52.43,56.59 48.34,56.59 47.12,57.81 31.11,57.81 30.61,57.3 18.49,57.3 17.07,58.73 17.07,61.42 v17.53,61.87
PC10/SD_D2  (via drill 0.4)
  Top 0.203: U5.111 65.03,48.97 65.13,49.07 65.13,53.14 65.94,53.95 v66.24,53.95
  Top 0.508: RM1.4.1 18.87,59.08 17.88,59.08 | 17.88,59.08 14.68,59.08 11.96,56.36 SD/MMC.1 | 17.88,59.08 17.88,58.93 v17.93,58.98 17.88,59.03 17.88,59.08
  Bottom 0.203: v66.24,53.95 65.94,53.65 63.3,53.65 61.37,55.58 57.71,55.58 54.46,58.83 54.46,63.6 52.93,65.13 33.43,65.13 29.16,60.86 19.2,60.86 18.59,60.25 18.59,59.64 v17.93,58.98
PC11/SD_D3  (via drill 0.4, 0.6)
  Top 0.203: U5.112 64.53,49.08 64.72,49.28 64.72,53.34 65.43,54.05 65.43,54.56 v65.63,54.76
  Top 0.508: SD/MMC.2 5.77,57.53 v11.58,57.53 | v17.58,65.15 R7.1
  Top 1.016: R7.1 R3.2
  Bottom 0.203: v65.63,54.76 65.33,55.07 63.09,55.07 61.77,56.39 58.12,56.39 55.27,59.23 55.27,64.01 53.34,65.94 34.65,65.94 33.63,66.95 32.61,66.95 32,66.34 32,65.48 28.6,62.08 21.23,62.08 18.16,65.15 v17.58,65.15
  Bottom 0.508: v11.58,57.53 11.58,60.71 16.03,65.15 v17.58,65.15
PC12/SD_CLK  (via drill 0.4, 0.6)
  Top 0.203: U5.113 64.03,49.19 64.31,49.48 64.31,53.95 v64.72,54.36
  Top 0.508: SD/MMC.5 5.33,60.73 v13.23,60.73
  Bottom 0.203: v64.72,54.36 63.2,54.36 61.57,55.98 57.91,55.98 54.86,59.03 54.86,63.8 53.14,65.53 34.44,65.53 33.43,66.55 32.82,66.55 32.41,66.14 32.41,65.33 28.75,61.67 21.03,61.67 20.12,62.59 15.09,62.59 v13.23,60.73
PC14
  Top 0.254: U5.8 44.28,42.59 41.86,45.01 R22.2 41.48,45.49 Q2.2 38.96,45.49 C33.1
PC15
  Top 0.254: U5.9 43.1,42.09 42.9,42.29 R22.1 41.48,42.95 Q2.1 38.96,42.95 C34.1
PD0  (via drill 0.4)
  Top 0.203: U5.114 63.53,49.3 63.91,49.68 63.91,54.56 65.13,55.78 v65.53,55.78
  Bottom 0.203: v65.53,55.78 64.62,55.78 63.2,57.2 61.27,57.2 60.35,58.12 60.35,66.14 57.3,69.19
  Bottom 1.016: 57.3,69.19 PD.3
PD1  (via drill 0.4)
  Top 0.203: U5.115 63.03,49.39 63.5,49.86 63.5,54.76 66.34,57.61 67.67,57.61 v67.97,57.3
  Bottom 0.203: 57.4,71.63 57.81,71.22 59.54,71.22 60.35,70.41 60.35,69.49 61.06,68.78 62.18,68.78 67.97,62.99 v67.97,57.3
  Bottom 1.016: 57.4,71.63 PD.4
PD2/SD_CMD  (via drill 0.4)
  Top 0.203: U5.116 62.53,49.47 63.09,50.04 63.09,55.37 v63.5,55.78 | v55.07,65.43 R23.1 | v33.12,65.84 34.14,65.84 v34.95,66.65
  Top 0.508: SD/MMC.3 13.12,58.56 14.4,59.84 17.58,59.84 v17.8,60.07 17.93,60.2 RM1.3.1
  Bottom 0.203: v63.5,55.78 62.48,56.79 60.15,56.79 57.81,59.13 57.81,62.69 v55.07,65.43 54.15,66.34 35.26,66.34 v34.95,66.65 | v33.12,65.84 33.12,65.41 28.98,61.27 19,61.27 v17.8,60.07
PD3  (via drill 0.4)
  Top 0.203: U5.117 62.03,49.56 62.69,50.22 62.69,55.98 63.6,56.9 v64.62,56.9 | v60.35,68.38 60.35,71.22 59.94,71.63
  Top 1.016: 59.94,71.63 PD.6
  Bottom 0.203: v64.62,56.9 65.43,57.71 65.43,64.92 61.98,68.38 v60.35,68.38
PD4  (via drill 0.4)
  Top 0.203: U5.118 61.53,49.64 62.28,50.39 62.28,56.19 63.7,57.61 65.13,57.61 65.53,58.01 v70.51,58.01
  Bottom 0.203: v70.51,58.01 70.51,62.69 69.8,63.4 68.17,63.4 61.98,69.6
  Bottom 1.016: 61.98,69.6 PD.7
PD5
  Top 0.203: U5.119 61.03,49.72 61.87,50.57 61.87,56.39 63.5,58.01 64.92,58.01 65.33,58.42 69.8,58.42 70.51,59.13 70.51,67.06 67.97,69.6 67.97,72.95 67.16,73.76 62.84,73.76 62.43,73.36
  Top 1.016: 62.43,73.36 PD.8
PD6
  Top 0.203: 65.02,69.09 65.43,68.68 65.43,59.13 64.72,58.42 63.3,58.42 59.64,54.76 59.64,49.38 59.53,49.27 U5.122
  Top 1.016: 65.02,69.09 PD.9
PD7
  Top 0.203: 63.3,71.68 62.89,71.27 62.89,58.62 59.23,54.97 59.23,49.58 59.03,49.38 U5.123
  Top 1.016: 63.3,71.68 PD.10
PD8  (via drill 0.4)
  Top 0.203: U5.77 69.11,30.59 69.22,30.48 82.5,30.48 83.11,31.09 83.11,33.83 85.95,36.68 85.95,66.95 v86.26,67.26
  Bottom 0.203: v86.26,67.26 85.85,67.26 85.14,67.97 68.68,67.97 67.16,69.49
  Bottom 1.016: 67.16,69.49 PD.11
PD9  (via drill 0.4)
  Top 0.203: U5.78 69.19,31.09 69.39,30.89 76.3,30.89 78.44,33.02 81.69,33.02 85.55,36.88 85.55,67.97 v85.85,68.28
  Bottom 0.203: 67.56,71.63 67.97,71.22 67.97,69.6 69.19,68.38 85.75,68.38 v85.85,68.28
  Bottom 1.016: 67.56,71.63 PD.12
PD10  (via drill 0.4)
  Top 0.203: U5.79 69.28,31.59 69.57,31.29 76.12,31.29 78.26,33.43 81.38,33.43 85.14,37.19 85.14,68.99 v85.34,69.19
  Bottom 0.203: v85.34,69.19 84.94,68.78 70.41,68.78 70,69.19
  Bottom 1.016: 70,69.19 PD.13
PD11
  Top 0.203: U5.80 69.36,32.09 69.75,31.7 75.95,31.7 78.08,33.83 81.18,33.83 84.73,37.39 84.73,68.78 78.23,75.29 71.98,75.29 69.65,72.95
  Top 1.016: 69.65,72.95 PD.14
PD12
  Top 0.203: U5.81 69.44,32.59 69.93,32.11 75.77,32.11 77.9,34.24 80.97,34.24 84.33,37.59 84.33,68.58 78.03,74.88 72.44,74.88 70.51,72.95 70.51,71.22 70.92,70.81
  Top 1.016: 70.92,70.81 PD.15
PD13
  Top 0.203: U5.82 69.53,33.09 70.1,32.51 75.59,32.51 77.72,34.65 80.77,34.65 83.92,37.8 83.92,68.38 77.83,74.47 73.71,74.47 72.19,72.95
  Top 1.016: 72.19,72.95 PD.16
PD14